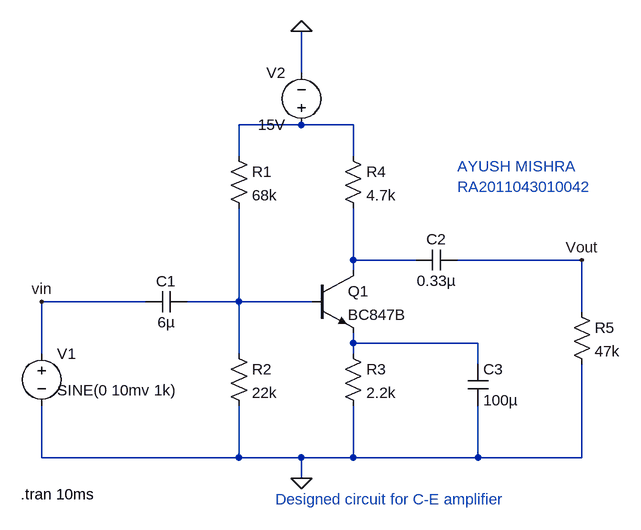
[diagram p0: schematic 1.asc]
1.asc, the LTspice schematic file:
Version 4
SHEET 1 880 680
WIRE 208 -224 208 -288
WIRE 208 -144 112 -144
WIRE 288 -144 208 -144
WIRE 112 -96 112 -144
WIRE 288 -96 288 -144
WIRE 288 64 288 -16
WIRE 384 64 288 64
WIRE 640 64 448 64
WIRE 288 80 288 64
WIRE -32 128 -192 128
WIRE 112 128 112 -16
WIRE 112 128 32 128
WIRE 224 128 112 128
WIRE 640 144 640 64
WIRE 288 192 288 176
WIRE 480 192 288 192
WIRE -192 208 -192 128
WIRE 112 208 112 128
WIRE 288 208 288 192
WIRE 480 224 480 192
WIRE -192 368 -192 288
WIRE 112 368 112 288
WIRE 112 368 -192 368
WIRE 208 368 112 368
WIRE 288 368 288 288
WIRE 288 368 208 368
WIRE 480 368 480 288
WIRE 480 368 288 368
WIRE 640 368 640 224
WIRE 640 368 480 368
WIRE 208 400 208 368
FLAG 208 400 0
FLAG 208 -288 0
FLAG 640 64 Vout
FLAG -192 128 vin
SYMBOL cap 32 112 R90
WINDOW 0 0 32 VBottom 2
WINDOW 3 32 32 VTop 2
SYMATTR InstName C1
SYMATTR Value 6µ
SYMBOL cap 448 48 R90
WINDOW 0 0 32 VBottom 2
WINDOW 3 32 32 VTop 2
SYMATTR InstName C2
SYMATTR Value 0.33µ
SYMBOL res 96 -112 R0
SYMATTR InstName R1
SYMATTR Value 68k
SYMBOL res 96 192 R0
SYMATTR InstName R2
SYMATTR Value 22k
SYMBOL res 272 192 R0
SYMATTR InstName R3
SYMATTR Value 2.2k
SYMBOL res 272 -112 R0
SYMATTR InstName R4
SYMATTR Value 4.7k
SYMBOL res 624 128 R0
SYMATTR InstName R5
SYMATTR Value 47k
SYMBOL cap 464 224 R0
SYMATTR InstName C3
SYMATTR Value 100µ
SYMBOL voltage -192 192 R0
WINDOW 3 24 72 Left 2
WINDOW 123 24 44 Left 2
WINDOW 39 0 0 Left 0
SYMATTR Value SINE(0 10mv 1k)
SYMATTR InstName V1
SYMBOL voltage 208 -128 R180
WINDOW 0 24 96 Left 2
WINDOW 3 24 16 Left 2
WINDOW 123 0 0 Left 0
WINDOW 39 0 0 Left 0
SYMATTR InstName V2
SYMATTR Value 15V
SYMBOL npn 224 80 R0
SYMATTR InstName Q1
SYMATTR Value BC847B
TEXT -224 424 Left 2 !.tran 10ms
TEXT 168 432 Left 2 ;Designed circuit for C-E amplifier
TEXT 448 -80 Left 2 ;AYUSH MISHRA\nRA2011043010042

The netlist it stands for:
* 1.asc
C1 N003 vin 6µ
C2 Vout N002 0.33µ
R1 N001 N003 68k
R2 N003 0 22k
R3 N004 0 2.2k
R4 N001 N002 4.7k
R5 Vout 0 47k
C3 N004 0 100µ
V1 vin 0 SINE(0 10mv 1k)
V2 N001 0 15V
Q1 N002 N003 N004 0 BC847B
.model NPN NPN
.model PNP PNP
.lib standard.bjt
.tran 10ms
* Designed circuit for C-E amplifier
* AYUSH MISHRA
* RA2011043010042
.backanno
.end